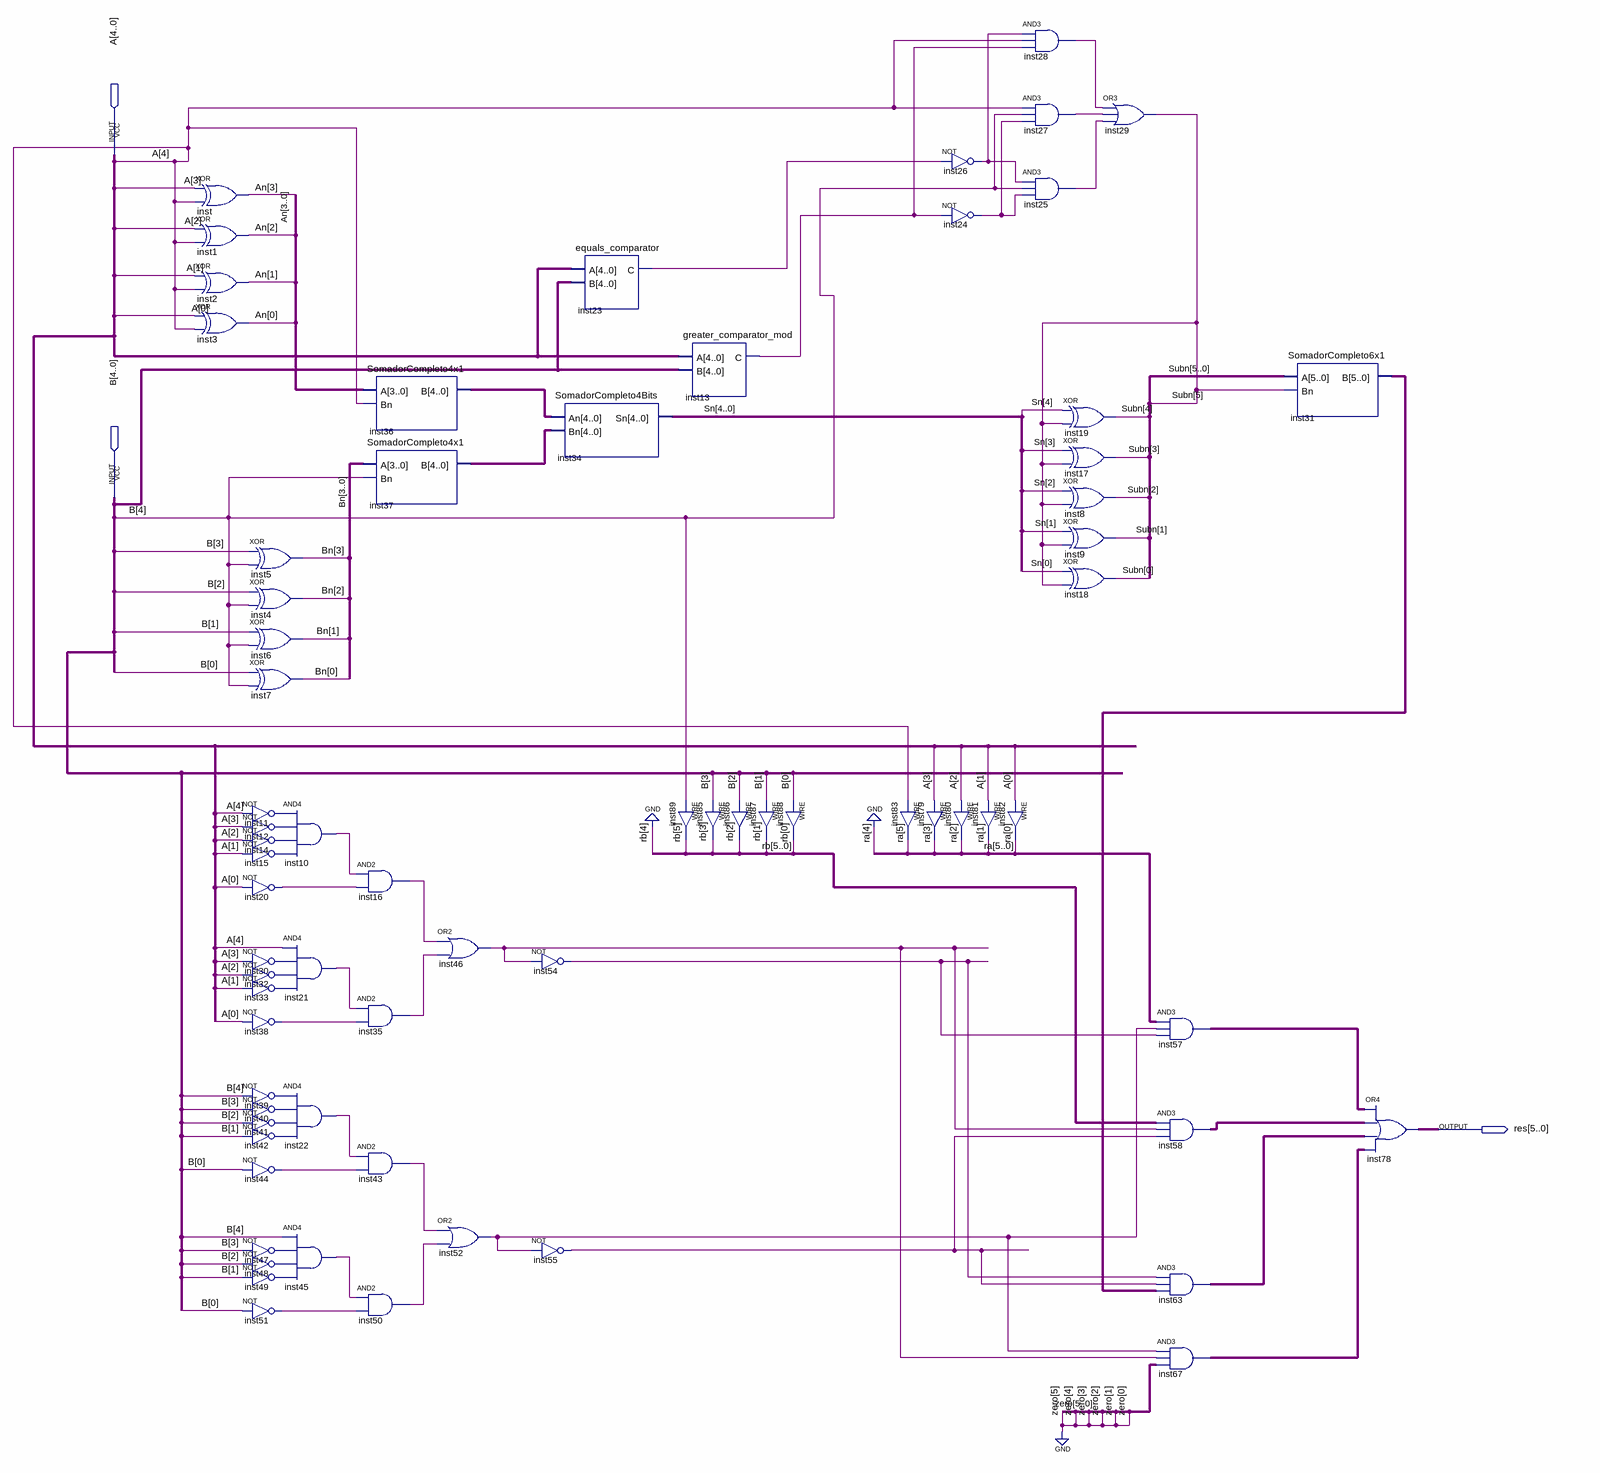
[diagram p0: schematic sheet]
// Quartus schematic SomadorFinal.bdf as structural Verilog: 70 symbols, 3 pins
module SomadorFinal (
  input  [4:0] A,
  input  [4:0] B,
  output [5:0] res
);

  wire inst10_out, inst11_out, inst12_out, inst13_c, inst14_out, inst15_out, inst16_out, inst20_out,
       inst21_out, inst22_out, inst23_c, inst24_out, inst25_out, inst26_out, inst27_out, inst28_out,
       inst30_out, inst32_out, inst33_out, inst35_out, inst38_out, inst39_out, inst40_out, inst41_out,
       inst42_out, inst43_out, inst44_out, inst45_out, inst46_out, inst47_out, inst48_out, inst49_out,
       inst50_out, inst51_out, inst52_out, inst54_out, inst55_out;
  wire [3:0] An, Bn;
  wire [4:0] inst36_b, inst37_b, Sn;
  wire [5:0] inst31_b, inst57_out, inst58_out, inst63_out, inst67_out, ra, rb, Subn;

  xor inst (An[3], A[3], A[4]);
  xor inst1 (An[2], A[2], A[4]);
  xor inst2 (An[1], A[1], A[4]);
  xor inst3 (An[0], A[0], A[4]);
  xor inst5 (Bn[3], B[3], B[4]);
  xor inst4 (Bn[2], B[2], B[4]);
  xor inst6 (Bn[1], B[1], B[4]);
  xor inst7 (Bn[0], B[0], B[4]);
  and inst10 (inst10_out, inst11_out, inst12_out, inst14_out, inst15_out);
  not inst11 (inst11_out, A[4]);
  not inst12 (inst12_out, A[3]);
  not inst14 (inst14_out, A[2]);
  not inst15 (inst15_out, A[1]);
  not inst20 (inst20_out, A[0]);
  and inst21 (inst21_out, A[4], inst30_out, inst32_out, inst33_out);
  not inst30 (inst30_out, A[3]);
  not inst32 (inst32_out, A[2]);
  not inst33 (inst33_out, A[1]);
  not inst38 (inst38_out, A[0]);
  and inst22 (inst22_out, inst39_out, inst40_out, inst41_out, inst42_out);
  not inst39 (inst39_out, B[4]);
  not inst40 (inst40_out, B[3]);
  not inst41 (inst41_out, B[2]);
  not inst42 (inst42_out, B[1]);
  not inst44 (inst44_out, B[0]);
  and inst45 (inst45_out, B[4], inst47_out, inst48_out, inst49_out);
  not inst47 (inst47_out, B[3]);
  not inst48 (inst48_out, B[2]);
  not inst49 (inst49_out, B[1]);
  not inst51 (inst51_out, B[0]);
  SomadorCompleto4x1 inst36 (.A(An), .Bn(A[4]), .B(inst36_b));
  SomadorCompleto4x1 inst37 (.A(Bn), .Bn(B[4]), .B(inst37_b));
  and inst16 (inst16_out, inst10_out, inst20_out);
  and inst35 (inst35_out, inst21_out, inst38_out);
  and inst43 (inst43_out, inst22_out, inst44_out);
  and inst50 (inst50_out, inst45_out, inst51_out);
  or inst46 (inst46_out, inst16_out, inst35_out);
  or inst52 (inst52_out, inst43_out, inst50_out);
  SomadorCompleto4Bits inst34 (.An(inst36_b), .Bn(inst37_b), .Sn(Sn));
  not inst54 (inst54_out, inst46_out);
  not inst55 (inst55_out, inst52_out);
  equals_comparator inst23 (.A(A), .B(B), .C(inst23_c));
  greater_comparator_mod inst13 (.A(A), .B(B), .C(inst13_c));
  assign rb[3] = B[3];  // WIRE inst85
  assign rb[5] = B[4];  // WIRE inst89
  assign rb[2] = B[2];  // WIRE inst86
  assign rb[1] = B[1];  // WIRE inst87
  assign rb[0] = B[0];  // WIRE inst88
  assign ra[3] = A[3];  // WIRE inst79
  assign ra[5] = A[4];  // WIRE inst83
  not inst26 (inst26_out, inst23_c);
  not inst24 (inst24_out, inst13_c);
  assign ra[2] = A[2];  // WIRE inst80
  assign ra[1] = A[1];  // WIRE inst81
  and inst28 (inst28_out, inst26_out, A[4], inst13_c);
  and inst27 (inst27_out, A[4], B[4], inst24_out);
  and inst25 (inst25_out, inst26_out, B[4], inst24_out);
  assign ra[0] = A[0];  // WIRE inst82
  xor inst19 (Subn[4], Sn[4], Subn[5]);
  xor inst17 (Subn[3], Sn[3], Subn[5]);
  xor inst8 (Subn[2], Sn[2], Subn[5]);
  xor inst9 (Subn[1], Sn[1], Subn[5]);
  xor inst18 (Subn[0], Sn[0], Subn[5]);
  or inst29 (Subn[5], inst28_out, inst27_out, inst25_out);
  assign inst57_out = {ra[5], 1'b0, ra[3:0]} & {6{inst52_out}} & {6{inst54_out}};  // AND3 inst57, 6 bits wide
  assign inst58_out = {rb[5], 1'b0, rb[3:0]} & {6{inst46_out}} & {6{inst55_out}};  // AND3 inst58, 6 bits wide
  assign inst63_out = {6{inst54_out}} & {6{inst55_out}} & inst31_b;  // AND3 inst63, 6 bits wide
  assign inst67_out = {6{inst52_out}} & {6{inst46_out}} & {6{1'b0}};  // AND3 inst67, 6 bits wide
  SomadorCompleto6x1 inst31 (.A(Subn), .Bn(Subn[5]), .B(inst31_b));
  assign res = inst57_out | inst58_out | inst63_out | inst67_out;  // OR4 inst78, 6 bits wide
endmodule
